# EAGLE board washberry (EAGLE 6.4)
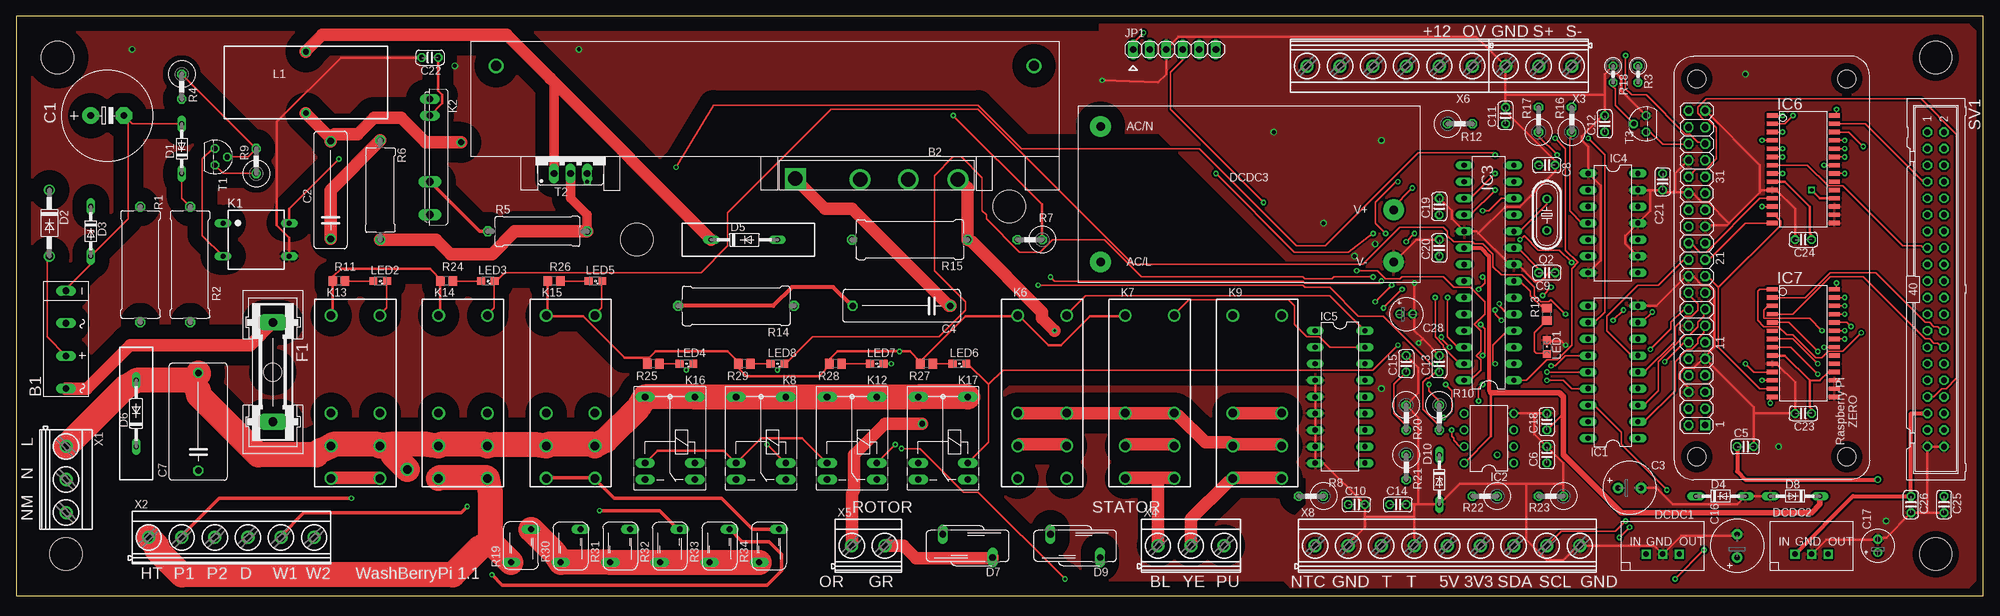
[diagram p3: board, top side]
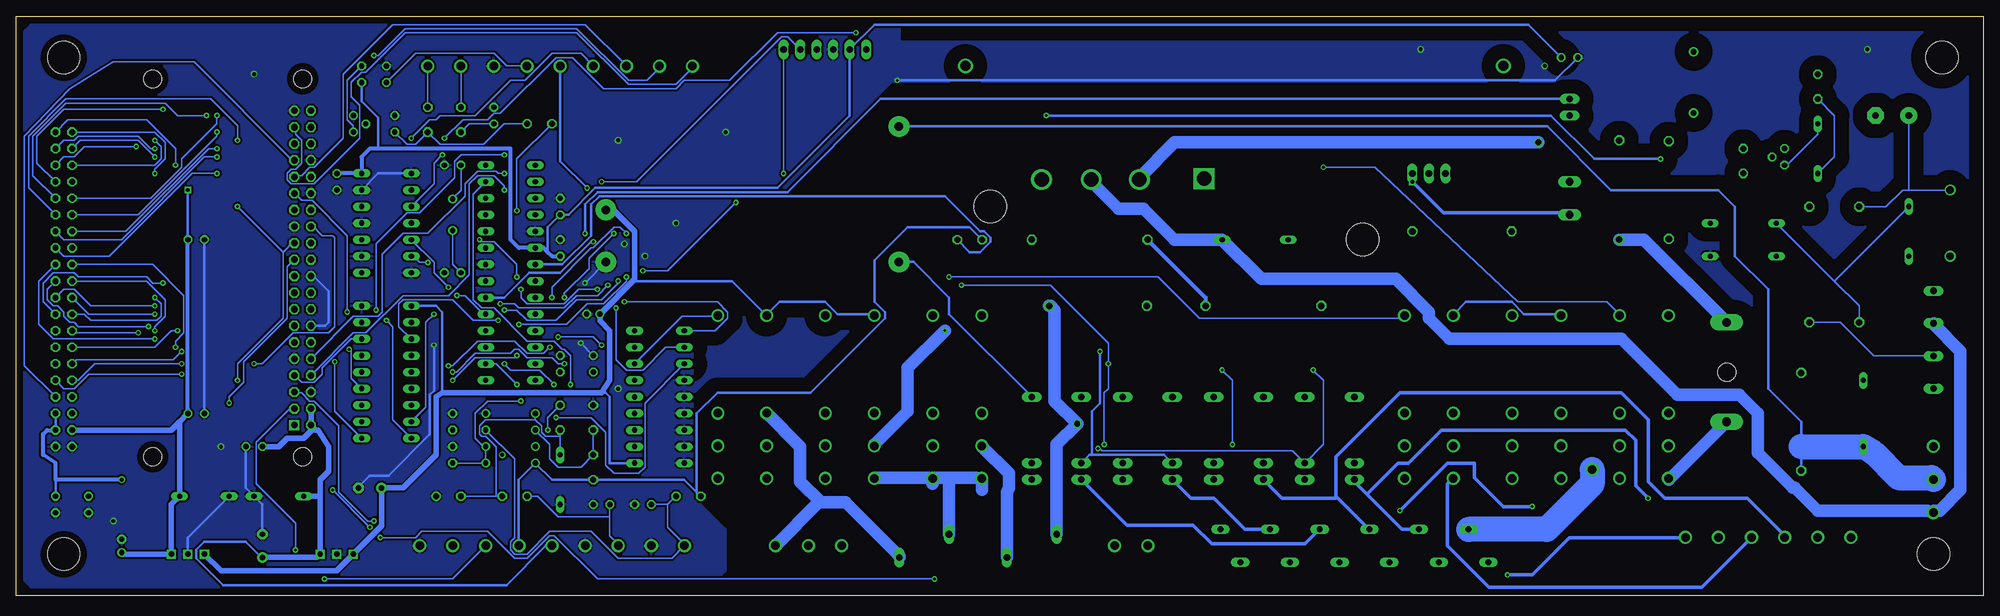
[diagram p4: board, bottom side, seen from below]

Size 301.93 x 88.89 mm. Coordinates in mm from the lower left corner, seen from the top.
Outline: 0,0 301.93,0 301.93,88.89 0,88.89 0,0
Copper layers (1*16): Top 0.035mm / dielectric 1.5mm / Bottom 0.035mm
Design rules "default *": minimum track width 5mil, minimum drill 0.4mm, track to track 6mil, track to pad 6mil, pad to pad 6mil, via to via 6mil, smd to smd 6mil, copper to edge 40mil, drill to drill 8mil, minimum pad ring 10mil, minimum via ring 8mil, stop-mask expansion 4mil, vias tented up to drill 0mil, thermal gap 10mil
Net classes: 0 default: width 0.254 mm; 1 10A: width 3.81 mm, drill 0.001 mm, clearance 1.016 mm; 2 5A: width 1.905 mm, drill 0.001 mm, clearance 1.016 mm; 3 2A: width 0.635 mm, drill 0.001 mm, clearance 1.016 mm; 4 0.5: width 0.508 mm, drill 0.001 mm, clearance 1.016 mm; 5 0.25: width 0.254 mm, clearance 1.016 mm; 6 12V: width 0.406 mm; 7 5V: width 0.406 mm; 8 3V3: width 0.406 mm; 9 small_signal: width 0.203 mm; 10 GND: width 0.406 mm; 11 TRIAC: width 0.406 mm
Holes 5 mm at 6.35,82.55 7.62,6.35 294.64,6.35 294.64,82.55 95.25,54.61 152.4,59.69

## Footprints (pad centres in the part's own frame; a part is rotated, then mirrored left to right if it is on the bottom)
2KBB = drill 1.016 long: + -2.616,0; - 7.391,0; AC1 -7.62,0; AC2 2.413,0
5S = drill 2.2 square: + 2.49,1.69 | drill 2.2: - 27.44,1.54; AC1 12.45,1.54; AC2 19.82,1.54
E5-13 = drill 1.016 pad 2.54: + -2.54,0 | drill 1.016 pad 2.54 octagon: - 2.54,0
C150-054X183 = drill 1.016 octagon: 1 -7.493,0; 2 7.493,0
E3,5-8 = drill 0.813 pad 1.6: + -1.778,0 | drill 0.813 pad 1.6 octagon: - 1.778,0
C025-024X044 = drill 0.813 octagon: 1 -1.27,0; 2 1.27,0
C150-091X182 = drill 1.016 octagon: 1 -7.493,0; 2 7.493,0
E2-5 = drill 0.813 pad 1.27: + -1.016,0 | drill 0.813 pad 1.27 octagon: - 1.016,0
DO34Z7 = drill 0.813 long: A 3.81,0; C -3.81,0
DO41-10 = drill 1.118: A 5.08,0; C -5.08,0
DO35-10 = drill 0.813 long: A 5.08,0; C -5.08,0
S10K300 = drill 1.016 long: 1 -1.778,-3.81; 2 1.778,3.81
SIPTO220 = drill 0.813 pad 1.397 square: 1 -2.54,-1.27; 2 0,-1.27; 3 2.54,-1.27
IRM_15/20 = drill 1.3 pad 3.17: AC/L -22.8,-10.4; AC/N -22.8,10.4; V+ 22.2,-2.4; V- 22.2,-10.4
GSH15 = drill 1.321 pad 2.54 long: 1 -7.62,0; 2 7.62,0 | hole 2.794: 0,0
DIL18 = drill 0.813 long: 1 -10.16,-3.81; 2 -7.62,-3.81; 3 -5.08,-3.81; 4 -2.54,-3.81; 5 0,-3.81; 6 2.54,-3.81; 7 5.08,-3.81; 8 7.62,-3.81; 9 10.16,-3.81; 10 10.16,3.81; 11 7.62,3.81; 12 5.08,3.81; 13 2.54,3.81; 14 0,3.81; 15 -2.54,3.81; 16 -5.08,3.81; 17 -7.62,3.81; 18 -10.16,3.81
DIL08 = drill 0.813 pad 1.27: 1 -3.81,-3.81; 2 -1.27,-3.81; 3 1.27,-3.81; 4 3.81,-3.81; 5 3.81,3.81; 6 1.27,3.81; 7 -1.27,3.81; 8 -3.81,3.81
DIL28-3 = drill 0.813 long: 1 -16.51,-3.81; 2 -13.97,-3.81; 3 -11.43,-3.81; 4 -8.89,-3.81; 5 -6.35,-3.81; 6 -3.81,-3.81; 7 -1.27,-3.81; 8 1.27,-3.81; 9 3.81,-3.81; 10 6.35,-3.81; 11 8.89,-3.81; 12 11.43,-3.81; 13 13.97,-3.81; 14 16.51,-3.81; 15 16.51,3.81; 16 13.97,3.81; 17 11.43,3.81; 18 8.89,3.81; 19 6.35,3.81; 20 3.81,3.81; 21 1.27,3.81; 22 -1.27,3.81; 23 -3.81,3.81; 24 -6.35,3.81; 25 -8.89,3.81; 26 -11.43,3.81; 27 -13.97,3.81; 28 -16.51,3.81
DIL14 = drill 0.813 long: 1 -7.62,-3.81; 2 -5.08,-3.81; 3 -2.54,-3.81; 4 0,-3.81; 5 2.54,-3.81; 6 5.08,-3.81; 7 7.62,-3.81; 8 7.62,3.81; 9 5.08,3.81; 10 2.54,3.81; 11 0,3.81; 12 -2.54,3.81; 13 -5.08,3.81; 14 -7.62,3.81
SO28W = smd 0.65 x 1.7: 1 -7.62,-4.78; 2 -6.35,-4.78; 3 -5.08,-4.78; 4 -3.81,-4.78; 5 -2.54,-4.78; 6 -1.27,-4.78; 7 0,-4.78; 8 1.27,-4.78; 9 2.54,-4.78; 10 3.81,-4.78; 11 5.08,-4.78; 12 6.35,-4.78; 13 7.62,-4.78; 14 8.89,-4.78; 15 8.89,4.78; 16 7.62,4.78; 17 6.35,4.78; 18 5.08,4.78; 19 3.81,4.78; 20 2.54,4.78; 21 1.27,4.78; 22 0,4.78; 23 -1.27,4.78; 24 -2.54,4.78; 25 -3.81,4.78; 26 -5.08,4.78; 27 -6.35,4.78; 28 -7.62,4.78
1X06 = drill 1.016 long: 1 -6.35,0; 2 -3.81,0; 3 -1.27,0; 4 1.27,0; 5 3.81,0; 6 6.35,0
AQY27 = drill 0.8 long: 1 -2.54,-5.08; 2 2.54,-5.08; 3 2.54,5.08; 4 -2.54,5.08
AQZ-SIL04 = drill 1 long: 1 -8.89,0; 2 -6.35,0 | drill 1.2 long: 3 3.81,0; 4 8.89,0
FTR-K1C = drill 1.3 pad 1.93: 1 -12.5,-3.75; 2 2.5,-3.75; 3 7.5,-3.75; 4 12.5,-3.75; 5 12.5,3.75; 6 7.5,3.75; 7 2.5,3.75; 8 -12.5,3.75
M3XXH = drill 1.016 long: 1 -3.81,3.81; 2 -3.81,-3.81; O -6.35,-3.81; P 6.35,-3.81; P@ 6.35,3.81; S -6.35,3.81
TJ5-U1 = drill 0.9: 1 -4.7,0; 2 4.7,0
CHIPLED_0805 = smd 1.2 x 1.2: A 0,-1.05; C 0,1.05
SML0805 = smd 1.2 x 1.2: A 1.05,0; C -1.05,0
HC49/S = drill 0.813: 1 -2.413,0; 2 2.413,0
0617/17 = drill 1.016 octagon: 1 -8.89,0; 2 8.89,0
0207/2V = drill 0.813 octagon: 1 -1.27,0; 2 1.27,0
0411V = drill 0.914 octagon: 1 -2.54,0; 2 1.27,0
P0613/15 = drill 1.016 octagon: 1 -7.62,0; 2 7.62,0
R0805 = smd 1.3 x 1.5: 1 -0.95,0; 2 0.95,0
S05K275 = drill 0.914 long: 1 -1.524,-2.54; 2 1.524,2.54
W_HEATSINK = drill 1.5: P$1 -40.64,5.08; P$2 41.91,5.08
ML40 = drill 0.914 octagon: 1 -24.13,-1.27; 2 -24.13,1.27; 3 -21.59,-1.27; 4 -21.59,1.27; 5 -19.05,-1.27; 6 -19.05,1.27; 7 -16.51,-1.27; 8 -16.51,1.27; 9 -13.97,-1.27; 10 -13.97,1.27; 11 -11.43,-1.27; 12 -11.43,1.27; 13 -8.89,-1.27; 14 -8.89,1.27; 15 -6.35,-1.27; 16 -6.35,1.27; 17 -3.81,-1.27; 18 -3.81,1.27; 19 -1.27,-1.27; 20 -1.27,1.27; 21 1.27,-1.27; 22 1.27,1.27; 23 3.81,-1.27; 24 3.81,1.27; 25 6.35,-1.27; 26 6.35,1.27; 27 8.89,-1.27; 28 8.89,1.27; 29 11.43,-1.27; 30 11.43,1.27; 31 13.97,-1.27; 32 13.97,1.27; 33 16.51,-1.27; 34 16.51,1.27; 35 19.05,-1.27; 36 19.05,1.27; 37 21.59,-1.27; 38 21.59,1.27; 39 24.13,-1.27; 40 24.13,1.27
TO92 = drill 0.813 octagon: 1 1.27,0; 2 0,1.905; 3 -1.27,0
TO220BV = drill 1.016 long: G 2.54,-2.54; T1 -2.54,-2.54; T2 0,-2.54
ZERO_NO_DIMENSION = drill 1.016 square: 1 8.37,25.24 | drill 1.016 octagon: 2 8.37,27.78; 3 10.91,25.24; 4 10.91,27.78; 5 13.45,25.24; 6 13.45,27.78; 7 15.99,25.24; 8 15.99,27.78; 9 18.53,25.24; 10 18.53,27.78; 11 21.07,25.24; 12 21.07,27.78; 13 23.61,25.24; 14 23.61,27.78; 15 26.15,25.24; 16 26.15,27.78; 17 28.69,25.24; 18 28.69,27.78; 19 31.23,25.24; 20 31.23,27.78; 21 33.77,25.24; 22 33.77,27.78; 23 36.31,25.24; 24 36.31,27.78; 25 38.85,25.24; 26 38.85,27.78; 27 41.39,25.24; 28 41.39,27.78; 29 43.93,25.24; 30 43.93,27.78; 31 46.47,25.24; 32 46.47,27.78; 33 49.01,25.24; 34 49.01,27.78; 35 51.55,25.24; 36 51.55,27.78; 37 54.09,25.24; 38 54.09,27.78; 39 56.63,25.24; 40 56.63,27.78 | hole 2.75: 3.5,3.5; 3.5,26.5; 61.5,26.5; 61.5,3.5
MKDSN1,5/3-5,08 = drill 1.3 pad 2: 1 -7.641,0.025; 2 -2.561,0.025; 3 2.519,0.025
MKDSN1,5/6-5,08 = drill 1.3 pad 2: 1 -12.7,0.025; 2 -7.62,0.025; 3 -2.54,0.025; 4 2.54,0.025; 5 7.62,0.025; 6 12.7,0.025
MKDSN1,5/2-5,08 = drill 1.3 pad 2: 1 -2.561,0.025; 2 2.519,0.025
MKDSN1,5/9-5,08 = drill 1.3 pad 2: 1 -20.341,0.025; 2 -15.261,0.025; 3 -10.181,0.025; 4 -5.101,0.025; 5 -0.021,0.025; 6 5.059,0.025; 7 10.139,0.025; 8 15.219,0.025; 9 20.299,0.025

## Placement (x,y rotation side)
B1  [2KBB]  7.62,39.37 90 top
B2  D15XB60  [5S]  117.1,62.3 0 top
C1  470µ  [E5-13]  13.97,73.66 0 top
C2  1nF  [C150-054X183]  48.26,62.23 90 top
C3  100µF  [E3,5-8]  247.65,16.51 0 top
C4  100nF  [C150-054X183]  135.89,44.45 180 top
C5  100nF  [C025-024X044]  265.43,22.86 0 top
C6  100nF  [C025-024X044]  234.95,21.59 90 top
C7  1nF  [C150-091X182]  27.94,26.67 90 top
C8  20pF  [C025-024X044]  234.95,66.04 0 top
C9  20pF  [C025-024X044]  234.95,49.53 0 top
C10  22nF  [C025-024X044]  205.74,13.97 0 top
C11  0 optional  [C025-024X044]  228.6,73.66 90 top
C12  100nF  [C025-024X044]  243.84,72.39 90 top
C13  22pF  [C025-024X044]  218.44,35.56 90 top
C14  100nF  [C025-024X044]  212.09,13.97 0 top
C15  100nF  [C025-024X044]  213.36,35.56 90 top
C16  100µF  [E3,5-8]  264.16,7.62 90 top
C17  100µF  [E2-5]  285.75,7.62 90 top
C18  100nF  [C025-024X044]  234.95,26.67 90 top
C19  100nF  [C025-024X044]  218.44,59.69 90 top
C20  100nF  [C025-024X044]  218.44,53.34 90 top
C21  100nF  [C025-024X044]  252.73,63.5 270 top
C22  100nF  [C025-024X044]  63.5,82.55 180 top
C23  100nF  [C025-024X044]  274.32,27.94 180 top
C24  100nF  [C025-024X044]  274.32,54.61 180 top
C25  100nF  [C025-024X044]  295.91,13.97 270 top
C26  100nF  [C025-024X044]  290.83,13.97 270 top
C28  [E2-5]  213.36,43.18 0 top
D1  12V  [DO34Z7]  25.4,68.58 90 top
D2  1N4004  [DO41-10]  5.08,57.15 270 top
D3  5V  [DO34Z7]  11.43,55.88 270 top
D4  5V8  [DO34Z7]  261.62,15.24 0 top
D5  [DO35-10]  111.76,54.61 0 top
D6  [DO35-10]  18.41,27.94 90 top
D7  S10K300  [S10K300]  146.05,7.62 90 top
D8  3V6  [DO34Z7]  273.05,15.24 180 top
D9  S10K300  [S10K300]  162.56,7.62 90 top
D10  3V3  [DO34Z7]  218.44,17.78 270 top
DCDC1  TSR1-2405  [SIPTO220]  252.73,7.62 0 top
DCDC2  TSR1-2405  [SIPTO220]  275.59,7.62 0 top
DCDC3  IRM-15-12  [IRM_15/20]  189.23,61.59 0 top
F1  5A  [GSH15]  39.37,34.29 270 top
IC1  ULN2803  [DIL18]  245.11,34.29 90 top
IC2  LM358N  [DIL08]  226.06,24.13 90 top
IC3  PIC18F2550_28DIP  [DIL28-3]  226.06,49.53 90 top
IC4  74HC04N  [DIL14]  245.11,57.15 270 top
IC5  ULN2803  [DIL18]  203.2,30.48 270 top
IC6  MCP23S17SO  [SO28W]  274.32,66.04 270 top
IC7  MCP23S17SO  [SO28W]  274.32,39.37 270 top
JP1  ISCP  [1X06]  177.8,83.82 0 top
K1  AQYAQY27  [AQY27]  36.83,54.61 270 top
K2  AQZ204  [AQZ-SIL04]  63.5,67.31 270 top
K6  FTR-K1C  [FTR-K1C]  157.48,30.48 270 top
K7  FTR-K1C  [FTR-K1C]  173.99,30.48 270 top
K8  M3XXH  [M3XXH]  114.3,24.13 90 top
K9  FTR-K1C  [FTR-K1C]  190.5,30.48 270 top
K12  M3XXH  [M3XXH]  128.27,24.13 90 top
K13  FTR-K1C  [FTR-K1C]  52.07,30.48 270 top
K14  FTR-K1C  [FTR-K1C]  68.58,30.48 270 top
K15  FTR-K1C  [FTR-K1C]  85.09,30.48 270 top
K16  M3XXH  [M3XXH]  100.33,24.13 90 top
K17  M3XXH  [M3XXH]  142.24,24.13 90 top
L1  [TJ5-U1]  44.45,78.74 270 top
LED1  [CHIPLED_0805]  234.95,38.1 0 top
LED2  [SML0805]  55.88,48.26 180 top
LED3  [SML0805]  72.39,48.26 180 top
LED4  [SML0805]  102.87,35.56 180 top
LED5  [SML0805]  88.9,48.26 180 top
LED6  [SML0805]  144.78,35.56 180 top
LED7  [SML0805]  132.08,35.56 180 top
LED8  [SML0805]  116.84,35.56 180 top
Q2  12MHz  [HC49/S]  234.95,58.42 270 top
R1  82K  [0617/17]  19.05,50.8 270 top
R2  100K  [0617/17]  26.67,50.8 270 top
R3  10K  [0207/2V]  248.92,80.01 270 top
R4  1K  [0411V]  25.4,77.47 270 top
R5  470  [P0613/15]  80.01,55.88 0 top
R6  68  [P0613/15]  55.88,62.23 270 top
R7  1K  [0411V]  154.94,54.61 180 top
R8  1K  [0411V]  198.12,15.24 180 top
R9  47K  [0411V]  36.83,67.31 90 top
R10  10K  [0411V]  218.44,26.67 270 top
R11  [R0805]  49.53,48.26 180 top
R12  1K  [0411V]  222.25,72.39 0 top
R13  1K  [R0805]  234.95,43.18 90 top
R14  68  [0617/17]  110.49,44.45 180 top
R15  68  [0617/17]  137.16,54.61 180 top
R16  0  [0411V]  238.76,73.66 90 top
R17  0  [0411V]  233.68,73.66 90 top
R18  470K  [0207/2V]  245.11,80.01 270 top
R19  S05K275  [S05K275]  77.47,7.62 180 top
R20  1K  [0411V]  213.36,26.67 270 top
R21  8K2  [0411V]  213.36,19.05 270 top
R22  1K  [0411V]  224.79,15.24 180 top
R23  47K  [0411V]  234.95,15.24 180 top
R24  [R0805]  66.04,48.26 180 top
R25  [R0805]  97.79,35.56 180 top
R26  [R0805]  82.55,48.26 180 top
R27  [R0805]  139.7,35.56 180 top
R28  [R0805]  125.73,35.56 180 top
R29  [R0805]  111.76,35.56 180 top
R30  S05K275  [S05K275]  85.09,7.62 0 top
R31  S05K275  [S05K275]  92.71,7.62 0 top
R32  S05K275  [S05K275]  100.33,7.62 0 top
R33  S05K275  [S05K275]  107.95,7.62 0 top
R34  S05K275  [S05K275]  115.57,7.62 0 top
SINK1  HEATSINK  [W_HEATSINK]  114.3,76.2 0 top
SV1  [ML40]  294.64,46.99 270 top
T1  BC547  [TO92]  30.48,67.31 270 top
T2  BTA25-6CWG  [TO220BV]  85.09,67.31 0 top
T3  BC547  [TO92]  250.19,72.39 90 top
U$3  ZERO  [ZERO_NO_DIMENSION]  284.48,17.78 90 top
X1  [MKDSN1,5/3-5,08]  7.62,15.24 270 top
X2  MKDSN1,5/6-5,08  [MKDSN1,5/6-5,08]  33.02,8.89 0 top
X3  MKDSN1,5/3-5,08  [MKDSN1,5/3-5,08]  231.14,81.28 180 top
X4  MKDSN1,5/3-5,08  [MKDSN1,5/3-5,08]  182.88,7.62 0 top
X5  MKDSN1,5/2-5,08  [MKDSN1,5/2-5,08]  130.81,7.62 0 top
X6  MKDSN1,5/6-5,08  [MKDSN1,5/6-5,08]  210.82,81.28 180 top
X8  MKDSN1,5/9-5,08  [MKDSN1,5/9-5,08]  219.71,7.62 0 top

## Tracks (layer width: path | path; a pad name or v marks a point on that pad's centre or on a via)
+3V3  (via drill 0.6)
  Top 0.305: 275.27,33.02 276.86,33.02 278.13,34.29 IC7.18
  Top 0.406: 226.38,31.11 226.38,24.45 IC2.8 | C22.1 64.77,77.47 65.41,76.83 65.41,75.56 K2.2 | IC7.9 271.46,36.83 275.27,33.02 275.27,28.89 275.59,28.57 C23.1 | IC6.9 271.46,63.5 275.27,59.69 275.27,55.56 275.59,55.24 C24.1 | C18.1 237.17,27.62 237.49,27.62 | v275.59,62.23 276.86,60.96 IC6.18
  Top 0.61: IC3.20 224.79,53.34 226.06,52.07 226.06,31.43 226.38,31.11
  Top 0.813: 226.38,31.11 236.85,31.11 237.49,30.48 237.49,27.62 237.49,21.59 246.38,12.7 275.59,12.7 276.86,13.97 D8.C
  Bottom 0.406: C24.1 v275.59,62.23 | 197.49,15.88 199.39,17.78 R21.2 219.71,17.78 IC2.8 224.79,17.78 224.79,7.94 X8.6 | 197.49,15.88 R8.2 | R7.2 155.57,56.52 165.1,56.52 170.18,51.44 170.18,45.09 168.59,43.5 168.59,42.55 180.02,31.11 194.31,31.11 197.49,27.94 197.49,15.88 | 220.5,52.86 220.34,53.02 220.34,56.52 C19.1 217.17,58.42 213.04,62.55 185.1,62.55 173.99,73.66 JP1.2 170.18,87.63 69.85,87.63 C22.1 | R3.2 248.92,75.88 246.38,73.34 246.38,68.58
  Bottom 0.61: C23.1 C24.1 | C20.1 219.71,52.07 220.5,52.86 220.98,53.34 IC3.20 224.79,53.34 226.06,54.61 226.06,68.58 246.38,68.58 247.65,68.58 248.92,67.31 IC4.14 C21.1
  Bottom 0.813: C17.+ 285.5,6.35 DCDC2.3 278.13,13.97 D8.C 276.86,26.67 | SV1.37 278.13,25.4 276.86,26.67 | 276.86,26.67 C23.1
+5V  (via drill 0.6)
  Top 0.61: C5.1 264.16,19.05 265.43,17.78 v285.75,17.78
  Bottom 0.406: 295.91,17.78 C25.1 | SV1.38 SV1.36 | X8.5 219.71,7.62 220.66,7.62 226.69,1.59 270.19,1.59 274.32,5.71 274.32,6.99 273.05,8.26 266.7,8.26 264.48,6.03 C16.+
  Bottom 0.61: v285.75,17.78 295.91,17.78 295.91,20.32 297.81,21.59 297.81,24.77 297.18,25.4 SV1.38
  Bottom 0.813: 255.27,15.24 DCDC1.3 255.78,5.84 C16.+ | D4.C 255.27,15.24 | 255.27,15.24 255.27,17.78 254,19.05 254,22.86 255.59,25.4 255.95,25.4 256.25,25.7 | 256.25,25.7 U$3.2 U$3.4 | C5.1 261.62,22.86 260.35,24.13 257.81,24.13 256.25,25.7
+12V  (via drill 0.4)
  Top 0.406: R11.2 48.58,43.18 K13.1 | K14.1 65.09,43.18 R24.2 65.41,48.26 63.5,50.16 49.85,50.16 48.58,48.9 R11.2 | R11.2 | R26.2 81.6,43.18 K15.1 81.6,42.86 87,42.86 93.34,36.51 97.16,36.51 | 97.16,36.51 98.11,37.47 109.22,37.47 111.12,35.56 R29.2 110.81,34.92 112.08,33.66 123.19,33.66 125.09,35.56 R28.2 124.78,36.2 126.05,37.47 v135.57,37.47 137.16,37.47 138.75,35.88 | 97.16,36.51 96.84,36.2 R25.2 | K16.1 98.42,22.23 108.58,22.23 K8.1 114.3,24.13 120.65,24.13 K12.1 | v214.31,62.55 211.14,59.37 DCDC3.V+ | 138.75,35.88 139.06,35.56 R27.2 138.75,35.88 | 138.75,35.88 145.73,42.86 153.67,42.86 K6.1 153.99,42.86 158.43,38.42 160.34,38.42 164.78,42.86 170.18,42.86 K7.1
  Top 0.61: DCDC2.1 281.94,15.24 C26.1 290.83,27.94 SV1.35
  Bottom 0.406: 236.54,31.11 236.54,43.5 237.49,44.45 IC1.10 | 212.09,31.11 211.46,31.11 210.82,30.48 210.82,20.32 IC5.10 | K14.1 65.09,43.18 70.48,43.18 72.39,45.09 79.38,45.09 81.28,43.18 K15.1 | K17.1 137.16,21.59 136.84,21.59 | 136.84,21.59 125.73,21.59 K12.1 | X6.2 218.44,66.67 v214.31,62.55 | K7.1 170.5,43.18 175.9,43.18 177.8,45.09 184.78,45.09 186.69,43.18 K9.1 187.01,43.18 192.09,48.26 206.69,48.26 207.01,48.51 | 136.84,21.59 136.84,28.26 135.57,29.53 v135.57,37.47
  Bottom 0.813: DCDC3.V+ 210.32,59.2 207.01,55.88 207.01,48.51 C28.+ 212.34,42.16 210.82,40.64 210.82,33.02 212.09,31.11 236.54,31.11 237.49,30.48 237.49,21.59 242.57,16.51 C3.+ 245.87,10.67 DCDC1.1 252.73,3.81 270.51,3.81 DCDC2.1
BOOST  (via drill 0.4)
  Top 0.203: v219.07,27.3 219.39,27.3 220.34,28.26 220.34,31.43 v219.39,32.38 | v227.01,35.56 226.69,35.88 226.69,38.42 228.92,40.64 IC3.4
  Bottom 0.203: IC5.3 205.42,29.53 205.42,19.68 206.38,18.73 210.19,18.73 211.46,20 211.46,25.08 213.68,27.3 v219.07,27.3 | v219.39,32.38 221.62,34.61 226.06,34.61 v227.01,35.56
CS0
  Top 0.254: IC6.11 267.65,60.96 259.4,52.7 258.44,52.7 256.86,54.29 U$3.24
CS1  (via drill 0.4)
  Top 0.254: IC7.11 266.7,34.29 v265.43,35.56
  Bottom 0.254: v265.43,35.56 264.16,35.56 259.4,40.32 254,40.32 253.05,41.27 253.05,54.93 253.37,55.24 254.95,55.24 256.54,56.83 U$3.26
DIRECTION  (via drill 0.4)
  Top 0.203: v211.14,47.62 v208.6,45.09 | v227.65,44.77 227.65,44.45 228.92,43.18 IC3.5 | v234.31,46.04 v235.59,47.31
  Bottom 0.203: IC5.1 194.63,40.64 192.72,42.55 192.72,43.5 194.31,45.09 v208.6,45.09 | v211.14,47.62 212.72,46.04 215.9,46.04 217.81,44.13 224.79,44.13 225.43,44.77 v227.65,44.77 | IC4.5 237.81,51.12 237.81,49.53 v235.59,47.31 | v234.31,46.04 233.04,46.04 230.19,43.18 IC3.5
GND  (via drill 0.4, 0.6)
  Top 0.406: C18.2 233.04,27.94 | 233.04,27.94 IC2.4 | 233.04,27.94 233.04,24.77 C6.2 237.49,20.32 237.49,17.14 | 237.49,17.14 R23.1 | C20.2 214.95,54.61 211.46,51.12 DCDC3.V- | IC5.4 IC5.5 IC5.6 IC5.7 IC5.8 IC5.9 200.66,20.32 C10.2 207.01,12.06 | 207.01,12.06 207.01,10.48 204.47,7.94 X8.2 | 214.63,43.18 214.63,40.64 215.9,39.37 | C13.2 215.9,39.37 | C15.2 215.26,34.92 215.26,31.11 R20.1 215.26,27.3 215.26,13.97 | 215.26,13.97 D10.A 221.62,17.14 231.78,17.14 | 215.26,13.97 214.63,13.97 | 214.63,13.97 C14.2 | 214.63,13.97 214.63,12.06 | 214.63,12.06 214.63,7.94 X8.4 | v215.26,38.73 215.9,39.37 | 214.63,12.06 207.01,12.06 | 214.63,43.18 v214.63,47.94 | 214.63,43.18 C28.- | 231.78,17.14 237.49,17.14 | v237.81,38.42 237.17,39.05 234.95,39.05 LED1.C | C16.- 264.16,9.21 255.59,9.21 DCDC1.2 251.46,7.62 240.03,7.62 X8.9 239.71,7.62 237.49,5.4 234.95,5.4 231.78,8.57 231.78,17.14 | SV1.40 SV1.39 293.37,12.7 | 293.37,12.7 C26.2 287.02,8.89 285.75,8.89 C17.- 285.75,8.57 277.81,8.57 DCDC2.2 | 293.37,12.7 C25.2 | IC1.9 251.78,44.45 256.54,49.21 U$3.20 256.86,48.9 257.49,48.9 258.76,47.62 259.71,47.62 260.67,46.67 260.67,38.1 259.08,36.51 | IC7.10 270.19,35.56 273.05,32.7 C23.2 266.7,27.94 | 259.08,36.51 257.49,34.92 256.22,34.92 255.27,33.97 255.27,33.34 256.54,32.07 256.54,31.43 U$3.6 | D8.A D4.A 264.16,13.97 254.32,13.97 251.78,16.51 C3.- | C5.2 266.7,27.94 | 266.7,27.94 266.7,28.89 259.4,36.2 U$3.9 259.08,36.51 | IC4.7 243.21,51.44 243.21,62.87 IC4.1 241.3,68.9 240.35,69.85 240.35,70.48 243.84,73.98 | IC4.9 247.01,53.98 247.01,55.24 IC4.11 250.82,59.05 250.82,62.23 | 250.82,62.23 C21.2 253.05,61.91 254.63,61.91
  Top 0.406: 250.82,62.23 IC4.13 | 254.63,61.91 256.54,61.91 U$3.30 256.86,61.59 257.49,61.59 258.76,60.33 259.71,60.33 262.89,57.15 | 254.63,61.91 254.63,64.77 256.54,66.67 U$3.34 | C24.2 273.05,59.37 270.19,62.23 IC6.10 267.97,62.23 267.65,61.91 | 267.65,61.91 262.89,57.15 | 262.89,57.15 262.57,56.83 259.4,56.83 U$3.25 | 267.65,61.91 267.65,66.04 259.4,74.3 U$3.39 | K1.3 41.91,54.93 40.01,56.83 40.01,72.71 49.85,82.55 C22.2 | C19.2 220.34,59.05 220.34,57.78 IC3.19 224.16,55.88 224.47,55.56 | 224.47,55.56 229.24,50.8 IC3.8 230.5,50.8 233.04,48.26 234,48.26 235.27,49.53 C9.2 | 243.84,76.83 243.84,80.01 244.79,80.96 | 243.84,76.83 243.84,73.98 | T3.1 246.38,77.47 246.38,79.38 244.79,80.96 | 244.79,80.96 R18.1 | 228.6,76.83 228.6,80.96 X3.3 228.6,81.28 224.16,85.72 178.44,85.72 JP1.3 176.53,80.01 175.26,78.74 v166.69,79.06 | 228.6,76.83 C11.2 228.6,74.3 236.22,66.67 C8.2 236.22,65.09 230.82,59.69 228.6,59.69 224.47,55.56 | 228.6,76.83 243.84,76.83 | 243.84,73.98 C12.2
  Bottom 0.406: C15.2 v215.26,38.73 | v214.63,47.94 211.46,51.12 DCDC3.V- | v237.81,38.42 237.81,31.43 238.44,30.8 238.44,24.77 244.79,18.41 247.65,18.41 249.56,16.51 C3.- | C5.2 266.7,16.51 D4.A 264.16,13.97 C16.- | DCDC2.2 275.59,8.89 D8.A | IC4.1 246.38,64.77 IC4.13 | C22.2 65.72,79.06 v166.69,79.06 | C24.2 C23.2 | U$3.14 254.52,41.39 254,41.91 254,46.67 256.22,48.9 256.58,48.9 U$3.20
  other vias: 193.04,71.12 209.55,69.85 265.43,80.01 270.51,22.86 287.02,11.43 209.55,31.75 17.78,83.82 200.66,57.15 205.42,52.07 208.6,53.98 67.31,81.28 86.36,83.82
  pour Bottom (isolate 2.184): 1.27,86.36 2.54,87.63 299.72,87.63 300.99,86.36 300.99,2.54 299.72,1.27 2.54,1.27 1.27,2.54
  pour Top (isolate 2.184): 1.27,86.36 2.54,87.63 299.72,87.63 300.99,86.36 300.99,2.54 299.72,1.27 2.54,1.27 1.27,2.54
  pour Bottom (isolate 0.305): 166.37,82.55 166.37,87.63 299.72,87.63 300.99,86.36 300.99,2.54 299.72,1.27 195.58,1.27 193.04,3.81 193.04,10.16 198.12,15.24 198.12,48.26 166.37,80.01
  pour Top (isolate 0.305): 166.37,80.01 166.37,87.63 299.72,87.63 300.99,86.36 300.99,2.54 299.72,1.27 195.58,1.27 194.31,2.54 194.31,10.16 198.12,13.97 198.12,48.26 196.85,49.53
GPA1.0  (via drill 0.4)
  Top 0.254: v280.67,64.77 IC6.21
  Bottom 0.254: v280.67,64.77 280.67,65.41 279.08,66.99 279.08,69.53 280.67,71.12 SV1.1
GPA1.1  (via drill 0.4)
  Top 0.254: v277.5,66.04 IC6.22
  Bottom 0.254: v277.5,66.04 277.5,68.58 281.94,73.03 294,73.03 SV1.2
GPA1.2  (via drill 0.4)
  Top 0.254: v280.67,67.31 IC6.23
  Bottom 0.254: v280.67,67.31 283.21,69.85 292.1,69.85 SV1.3
GPA1.3  (via drill 0.4)
  Top 0.254: v280.67,68.58 IC6.24
  Bottom 0.254: v280.67,68.58 281.31,68.58 283.21,70.48 292.42,70.48 293.05,69.85 294.64,69.85 SV1.4
GPA1.4  (via drill 0.4)
  Top 0.254: v280.67,69.85 IC6.25
  Bottom 0.254: v280.67,69.85 279.72,68.9 279.72,66.99 280.67,66.04 SV1.5
GPA1.5  (via drill 0.4)
  Top 0.254: IC6.26 281.31,71.12 v283.53,68.9
  Bottom 0.254: v283.53,68.9 291.46,68.9 293.05,67.31 294.64,67.31 SV1.6
GPA1.6
  Top 0.254: IC6.27 283.85,72.39 292.74,63.5 SV1.7
GPA1.7  (via drill 0.4)
  Top 0.254: v279.4,74.61 279.4,73.66 IC6.28
  Bottom 0.254: v279.4,74.61 294.64,74.61 298.77,70.48 298.77,66.36 SV1.8
GPA2.0  (via drill 0.4)
  Top 0.254: v277.5,38.1 IC7.21
  Bottom 0.254: v277.5,38.1 277.5,39.05 276.23,40.32 276.23,46.04 280.99,50.8 SV1.17
GPA2.1  (via drill 0.4)
  Top 0.254: v280.67,39.37 IC7.22
  Bottom 0.254: v280.67,39.37 296.23,39.37 298.45,41.59 298.45,48.26 SV1.18
GPA2.2  (via drill 0.4)
  Top 0.254: v280.67,40.64 IC7.23
  Bottom 0.254: v280.67,40.64 280.67,41.27 279.08,42.86 279.08,45.4 281.94,48.26 SV1.19
GPA2.3  (via drill 0.4)
  Top 0.254: IC7.24 280.99,41.91 v281.62,41.27
  Bottom 0.254: v281.62,41.27 292.42,41.27 293.05,41.91 293.69,41.91 294.64,42.86 294.64,43.5 295.59,44.45 296.23,44.45 297.18,45.4 297.18,46.99 SV1.20
GPA2.4  (via drill 0.4)
  Top 0.254: v280.67,43.18 IC7.25
  Bottom 0.254: v280.67,43.18 290.83,43.18 SV1.21
GPA2.5  (via drill 0.4)
  Top 0.254: v280.67,44.45 IC7.26
  Bottom 0.254: v280.67,44.45 290.51,44.45 293.05,46.99 294.64,46.99 SV1.22
GPA2.6  (via drill 0.4)
  Top 0.254: v280.67,45.72 IC7.27
  Bottom 0.254: v280.67,45.72 279.72,44.77 279.72,42.86 280.35,42.23 290.51,42.23 291.46,43.18 SV1.23
GPA2.7  (via drill 0.4)
  Top 0.254: v279.4,47.94 279.4,46.99 IC7.28
  Bottom 0.254: v279.4,47.94 280.99,47.94 281.94,48.9 292.42,48.9 293.05,49.53 296.23,49.53 297.81,47.94 297.81,45.09 SV1.24
GPB1.0  (via drill 0.4)
  Top 0.254: v271.14,73.66 IC6.1
  Bottom 0.254: v271.14,73.66 271.14,72.39 276.54,66.99 276.54,65.72 281.31,60.96 SV1.9
GPB1.1  (via drill 0.4)
  Top 0.254: IC6.2 271.46,72.39 v272.73,73.66
  Bottom 0.254: v272.73,73.66 277.18,73.66 279.08,75.56 294.32,75.56 299.4,70.48 299.4,64.45 SV1.10
GPB1.2  (via drill 0.4)
  Top 0.254: v271.14,71.12 IC6.3
  Bottom 0.254: v271.14,71.12 271.14,70.48 283.21,58.42 SV1.11
GPB1.3  (via drill 0.4)
  Top 0.254: v267.97,69.85 IC6.4
  Bottom 0.254: v267.97,69.85 267.97,72.07 272.1,76.2 294.32,76.2 300.04,70.48 300.04,62.55 SV1.12
GPB1.4  (via drill 0.4)
  Top 0.254: v271.14,68.58 IC6.5
  Bottom 0.254: v271.14,68.58 272.42,68.58 285.12,55.88 SV1.13
GPB1.5  (via drill 0.4)
  Top 0.254: v271.14,67.31 IC6.6
  Bottom 0.254: v271.14,67.31 273.05,67.31 285.75,54.61 294.64,54.61 SV1.14
GPB1.6
  Top 0.254: IC6.7 274.95,66.04 278.13,62.87 280.35,62.87 289.56,53.66 292.42,53.66 292.74,53.34 SV1.15
GPB1.7  (via drill 0.4)
  Top 0.254: v271.14,64.77 IC6.8
  Bottom 0.254: v271.14,64.77 274.95,64.77 287.65,52.07 294.64,52.07 SV1.16
GPB2.0  (via drill 0.4)
  Top 0.254: IC7.1 267.65,46.99 267.33,46.67 267.33,42.23 268.29,41.27 270.51,41.27 271.78,40.01 272.73,40.01 276.23,36.51 277.18,36.51 278.13,37.47 280.35,37.47 v283.21,40.32
  Bottom 0.254: v283.21,40.32 293.05,40.32 SV1.25
GPB2.1
  Top 0.254: IC7.2 274.64,45.72 278.45,49.53 285.43,49.53 293.05,41.91 293.69,41.91 294.32,41.27 294.96,41.27 295.59,40.64 SV1.26
GPB2.2  (via drill 0.4)
  Top 0.254: IC7.3 268.92,44.45 268.29,43.81 268.29,42.55 275.27,42.55 v277.18,40.64
  Bottom 0.254: v277.18,40.64 278.13,40.64 280.67,38.1 SV1.27
GPB2.3
  Top 0.254: IC7.4 272.73,43.18 278.45,48.9 283.53,48.9 293.05,39.37 293.69,39.37 294.32,38.73 294.96,38.73 295.59,38.1 SV1.28
GPB2.4  (via drill 0.4)
  Top 0.254: IC7.5 272.1,41.91 v276.54,37.47
  Bottom 0.254: v276.54,37.47 277.81,36.2 292.74,36.2 SV1.29
GPB2.6  (via drill 0.4)
  Top 0.254: IC7.7 272.73,39.37 v276.54,35.56
  Bottom 0.254: v276.54,35.56 289.88,35.56 292.42,33.02 SV1.31
GPB2.7  (via drill 0.4)
  Top 0.254: IC7.8 272.42,38.1 v276.54,33.97
  Bottom 0.254: v276.54,33.97 290.83,33.97 293.05,31.75 294.64,31.75 SV1.32
GPIO1  (via drill 0.4)
  Top 0.203: v253.05,35.88 255.91,38.73 256.54,38.73 U$3.12
  Bottom 0.203: IC1.1 253.05,28.26 v253.05,35.88
GPIO2
  Top 0.203: IC1.2 249.87,26.67 254.63,31.43 254.63,35.88 256.54,37.78 257.18,37.78 258.13,38.73 258.13,39.37 259.08,40.32 259.08,41.27 U$3.13
GPIO3
  Top 0.203: IC1.3 249.87,29.21 252.09,31.43 252.09,35.88 256.22,40.01 256.86,40.01 258.13,41.27 258.13,41.91 259.08,42.86 259.08,43.81 U$3.15
GPIO4  (via drill 0.4)
  Top 0.203: v250.82,37.78 254,40.96 254,41.91 255.91,43.81 256.54,43.81 U$3.16
  Bottom 0.203: IC1.4 250.51,33.34 250.51,37.47 v250.82,37.78
GPIO5
  Top 0.203: IC1.5 249.87,34.29 254.63,39.05 254.63,41.27 256.22,42.86 257.18,42.86 258.13,43.81 258.13,44.77 256.54,46.35 U$3.18
GPIO6
  Top 0.203: IC1.6 247.97,36.83 244.16,40.64 244.16,42.86 248.92,47.62 252.09,47.62 255.91,51.44 256.54,51.44 U$3.22
GPIO7
  Bottom 0.203: IC1.7 250.51,39.37 254.95,34.92 254.95,33.97 256.22,32.7 258.13,32.7 259.08,33.66 U$3.7
GPIO21  (via drill 0.4)
  Top 0.203: IC1.8 249.56,41.91 v251.14,43.5
  Bottom 0.203: v251.14,43.5 251.14,55.24 256.54,60.64 258.13,60.64 259.08,61.59 U$3.29
GPIO27
  Top 0.203: T3.3 250.82,71.12 252.73,69.22 256.54,69.22 U$3.36
  Bottom 0.203: T3.3 250.19,72.07 251.14,73.03 251.14,79.06 R3.1
INT  (via drill 0.4)
  Top 0.406: K1.4 41.91,59.37 v49.53,66.99 | v143.83,73.66 157.48,60.01 R7.1
  Bottom 0.406: v49.53,66.99 59.69,66.99 66.36,73.66 v143.83,73.66 | IC3.21 218.12,50.8 213.68,55.24 213.68,60.01 212.41,61.28 159.38,61.28 153.99,55.88 153.35,55.88 152.4,54.93 152.4,54.29 153.99,52.7 155.57,52.7 R7.1
L  (via drill 1.3)
  Top 3.81: K17.P K17.P@ K12.P K12.P@ K8.P K8.P@ K16.P K16.P@ 95.57,28.89 90.49,23.81 K15.6 88.58,23.18 81.6,23.18 K15.3 79.69,23.18 73.98,23.18 K14.6 72.07,23.18 65.09,23.18 K14.3 63.18,23.18 57.47,23.18 | 26.99,33.02 D6.A 16.83,32.07 7.94,23.18 X1.1 | 26.99,33.02 27.94,33.97 C7.2 | 57.47,23.18 K13.6 55.56,23.18 48.58,23.18 K13.3 46.67,22.23 46.04,21.59 37.15,21.59 27.94,30.8 27.94,31.43 26.99,33.02 | R19.1 79.06,10.16 82.55,6.67 R30.1 R31.1 R32.1 R33.1 R34.1 | v60.01,19.37 57.78,21.59 57.47,23.18
  Bottom 0.406: DCDC3.AC/L 164.22,51.2 158.75,45.72 158.75,43.18 K17.P
  Bottom 3.81: R19.1 66.99,10.16 60.01,17.14 v60.01,19.37
L-MOTOR
  Top 1.905: K13.4 48.58,18.1 55.56,18.1 K13.5
  Bottom 1.905: F1.2 48.26,17.78 K13.4
MISO  (via drill 0.4)
  Top 0.254: v269.24,29.53 269.24,30.48 IC7.14 | IC6.14 265.43,57.15 260.03,51.75 259.4,51.75 U$3.21
  Bottom 0.254: v269.24,29.53 269.24,30.48 267.02,32.7 267.02,35.88 260.35,42.55 260.35,50.48 259.4,51.44 U$3.21
MOSI
  Top 0.254: IC7.13 267.65,31.75 261.3,38.1 261.3,47.31 | 261.3,47.31 259.4,49.21 U$3.19 | IC6.13 269.88,58.42 270.83,57.47 270.83,56.83 261.3,47.31
N
  Bottom 0.406: DCDC3.AC/N 66.92,72 57.15,62.23 40.64,62.23 38.1,59.69 38.1,52.07 33.02,46.99 33.02,31.75 27.94,26.67 27.94,22.86 C7.1
  Bottom 3.81: 27.94,22.86 D6.C 16.83,21.91 13.02,18.1 7.94,18.1 X1.2
N$1
  Top 0.254: K1.2 28.57,55.24 28.57,66.99 30.16,68.58 T1.3
N$2
  Top 0.254: B1.- 7.62,46.99 11.43,50.8 D3.A 17.14,57.78 17.14,73.03 | T1.1 31.75,64.77 R9.1 | D1.A 17.78,72.39 17.14,73.03 | 17.14,73.03 C1.-
  Bottom 0.254: T1.1 30.16,66.04 25.4,70.8 D1.A
N$3
  Bottom 0.254: R1.1 14.92,59.69 12.38,62.23 11.43,62.23 | D2.C 11.43,62.23 | 11.43,62.23 C1.+
N$4
  Bottom 0.254: 22.86,48.26 19.05,44.45 R1.2 | 22.86,48.26 K1.1 | 22.86,48.26 D3.C
N$5
  Top 0.203: IC3.7 230.82,48.26 232.41,46.67 232.41,46.04 234.31,44.13 R13.2
N$6
  Top 0.203: LED1.A 234.95,37.15 233.36,37.15 233.04,37.47 233.04,40.32 R13.1
N$7
  Top 0.254: D1.C 25.4,60.96 R2.1
  Bottom 0.254: R4.2 22.86,73.66 22.86,67.31 D1.C
N$8  (via drill 0.4)
  Top 0.254: IC1.11 242.25,41.91 243.84,43.5 243.84,67.63 v241.3,70.17
  Bottom 0.254: v241.3,70.17 238.44,73.03 237.49,73.03 236.85,73.66 231.46,73.66 226.06,79.06 223.84,79.06 219.71,83.19 215.26,83.19 213.36,81.28 X6.3
N$9
  Top 0.254: T1.2 35.56,67.31 R9.2 R4.1
N$10
  Top 0.254: D2.A 4.76,51.75 4.76,39.69 7.62,36.83 B1.+
  Bottom 0.254: R2.2 21.91,41.91 16.83,36.83 7.62,36.83 B1.+
N$11
  Top 0.203: T3.2 245.43,75.25 245.43,77.79 245.11,78.11 R18.2
  Bottom 0.203: R18.2 240.66,83.19 228.6,83.19 226.69,81.28 223.52,81.28 X6.1
N$12  (via drill 0.6)
  Top 0.508: v87.63,63.5 T2.G
  Bottom 0.508: v87.63,63.5 82.87,58.74 63.82,58.74 K2.4
N$13
  Top 0.508: R5.1 71.12,55.88 K2.3
N$14  (via drill 0.4)
  Top 0.254: IC2.7 221.62,22.86 220.66,23.81 220.66,24.13 220.34,24.45 v220.34,25.4 | v216.85,32.38 216.85,31.43 218.44,29.84 R10.1
  Bottom 0.254: v220.34,25.4 220.34,27.3 R10.1 | IC3.13 231.78,61.59 231.78,45.4 230.5,44.13 228.6,44.13 223.52,39.05 219.39,39.05 218.12,37.78 217.81,37.78 216.85,36.83 v216.85,32.38
N$15  (via drill 0.4)
  Top 0.254: LED2.C 56.83,48.26 56.83,44.13 55.88,43.18 K13.8 | v246.7,43.81 v245.11,42.23 | v227.01,67.63 226.69,67.94 215.26,67.94 200.98,53.66 196.53,53.66 181.61,68.58 154.31,68.58 147.64,75.25 107,75.25 v101.28,65.72
  Bottom 0.254: IC1.18 244.16,26.99 244.16,41.27 v245.11,42.23 | v246.7,43.81 246.7,53.98 241.94,58.74 240.03,58.74 234.63,64.14 234.63,66.67 233.68,67.63 v227.01,67.63 | v101.28,65.72 93.34,65.72 71.44,45.09 57.78,45.09 55.88,43.18 K13.8
N$16  (via drill 0.4)
  Top 1.905: K7.3 170.5,23.18 177.48,23.18 K7.6 | B2.- 144.78,63.82 146.05,62.55 R15.1 146.69,54.29 157.48,43.5 157.48,42.55 v159.38,40.64
  Bottom 1.905: v159.38,40.64 165.1,34.92 165.1,28.26 170.18,23.18 K7.3
N$17
  Top 1.905: C2.1 48.26,62.23 R6.1
N$18  (via drill 0.9)
  Top 1.905: 48.26,70.17 44.45,73.98 L1.2 | C2.2 48.26,70.17 | v68.26,69.53 62.87,69.53 59.05,73.34 54.93,73.34 52.39,70.8 48.9,70.8 48.26,70.17
  Bottom 1.905: v68.26,69.53 124.14,69.53 129.54,64.14 B2.AC1
N$19  (via drill 0.4)
  Top 0.254: v225.11,32.38 224.47,31.75 v224.47,29.84
  Bottom 0.254: 229.87,22.54 IC2.1 C6.1 | IC3.2 228.28,35.56 v225.11,32.38 | v224.47,29.84 229.55,29.84 231.46,27.94 231.46,24.13 229.87,22.54 | 229.87,22.54 IC2.2
N$20
  Top 1.905: K9.5 193.99,18.1 187.01,18.1 K9.4 186.06,17.46 180.34,11.75 180.34,7.94 X4.2
N$21
  Top 1.905: K9.2 187.01,27.94 193.99,27.94 K9.7
  Bottom 1.905: K9.2 186.69,27.94 181.61,22.86 181.61,17.46 178.44,14.29 | 178.44,14.29 174.62,14.29 166.37,6.03 D9.1 | X4.3 185.1,7.94 179.07,13.97 178.44,14.29
N$22
  Top 0.254: R11.1 LED2.A
N$23
  Top 1.422: T2.T1 82.55,78.74 81.92,79.38
  Top 1.905: D5.C 81.92,79.38 75.25,86.04 46.99,86.04 44.45,83.5 L1.1
N$24  (via drill 0.9)
  Top 1.905: C4.1 143.19,44.45 128.27,59.37 124.14,59.37 119.7,63.82 B2.+ | v139.06,26.35 133.35,26.35 128.59,21.59 128.59,16.19 128.27,15.56 128.27,7.94 X5.1
  Bottom 1.905: C4.1 143.19,44.45 142.56,43.81 142.56,29.84 v139.06,26.35 142.24,23.18 D7.2
N$25
  Top 0.203: IC3.9 230.5,53.34 233.68,50.16 C9.1
  Bottom 0.203: Q2.2 234.95,50.8 C9.1
N$26
  Top 0.203: IC3.10 230.82,55.88 234.95,60.01 Q2.1
  Bottom 0.203: C8.1 233.68,62.23 234.95,60.96 Q2.1
N$27  (via drill 0.4)
  Top 0.203: IC3.12 227.97,60.96 226.06,59.05 v225.11,59.05
  Bottom 0.203: v225.11,59.05 225.11,66.99 R12.1
N$28  (via drill 0.4)
  Top 0.254: v236.54,67.63 233.68,70.48 R17.1
  Bottom 0.254: C11.1 232.41,72.39 R17.1 | IC4.3 237.81,63.18 237.81,66.36 v236.54,67.63
N$29
  Top 0.254: IC4.4 240.35,57.15 238.44,59.05 238.44,70.17 238.76,70.48 R16.1
  Bottom 0.254: C12.1 241.94,69.22 240.66,69.22 R16.1 236.85,69.22 230.19,69.22 227.01,72.39 R12.2
N$30  (via drill 0.4)
  Top 0.254: K14.8 72.39,43.18 73.34,44.13 73.34,48.26 LED3.C 73.66,48.26 74.93,49.53 105.09,49.53 109.22,53.66 109.22,58.74 125.09,74.61 147.64,74.61 171.45,50.8 206.69,50.8 212.41,56.52 219.07,56.52 219.71,55.88 219.71,55.24 220.66,54.29 223.52,54.29 223.84,53.98 225.11,53.98 226.69,52.39 226.69,50.48 227.97,49.21 231.14,49.21 233.04,47.31 233.04,46.04 234,45.09 235.27,45.09 235.59,45.4 v237.81,43.18
  Bottom 0.254: IC1.17 239.08,28.89 239.08,41.91 v237.81,43.18
N$31
  Bottom 0.635: R14.1 119.38,45.72 R15.2
N$32
  Top 0.635: R14.2 116.2,44.45 119.06,47.31 125.41,47.31 128.27,44.45 C4.2
N$33
  Top 1.905: K9.6 193.99,23.18 187.01,23.18 K9.3 186.06,23.5 182.56,23.5 178.44,27.62 K7.7 177.48,27.94 170.5,27.94 K7.2 169.54,27.94 161.93,27.94 K6.7 160.97,27.94 153.99,27.94 K6.2
N$34
  Top 1.905: 175.26,18.1 177.48,18.1 K7.5 | 175.26,18.1 170.5,18.1 K7.4 | 175.26,18.1 175.26,7.94 X4.1
  Bottom 1.905: 153.67,16.19 153.67,17.78 K6.4 154.62,18.1 158.75,18.1 | 158.75,18.1 160.97,18.1 K6.5 | 161.29,17.14 K6.5 | K7.4 170.18,18.1 161.93,18.1 K6.5 | 158.75,18.1 D9.2
N$35
  Top 1.905: K6.3 153.99,23.18 160.97,23.18 K6.6 | X5.2 133.35,7.62 136.21,7.62 138.11,5.71 149.86,5.71 D7.1
  Bottom 1.905: K6.3 153.67,22.86 149.54,18.73 149.54,16.51 149.86,15.88 D7.1
N$36
  Top 0.254: IC5.18 201.61,46.04 164.15,46.04 161.29,43.18 K6.8
N$37
  Bottom 0.254: R16.2 238.76,80.96 X3.1
N$38
  Bottom 0.254: R17.2 233.68,80.96 X3.2
N$39
  Top 0.254: C15.1 211.46,32.38 211.46,27.94 213.36,26.04 R20.2
  Bottom 0.254: IC2.6 220.03,23.18 220.03,20.95 218.76,19.68 215.26,19.68 R21.1 R20.2
N$40
  Top 0.254: R24.1 LED3.A
N$41
  Top 0.254: C13.1 217.81,34.29 216.85,33.34 216.53,33.34 215.9,32.7 215.9,28.57 218.44,26.04 R10.2
  Bottom 0.254: R23.2 228.28,15.24 | 228.28,15.24 R22.1 | R10.2 218.44,24.45 | 218.44,24.45 D10.C | 222.25,26.99 IC2.5 | 222.25,26.99 221.3,26.04 221.3,25.08 220.66,24.45 218.44,24.45 | 228.28,15.24 228.28,22.86 229.87,24.45 230.5,24.45 230.82,24.77 230.82,26.04 229.87,26.99 222.25,26.99
N$42  (via drill 0.4)
  Top 0.254: v102.87,34.61 103.82,35.56 LED4.C | IC1.16 242.25,29.21 246.38,25.08 246.38,23.18 v253.37,16.19 | v246.06,8.89 v247.65,10.48 | v135.89,22.54 138.75,22.54 145.41,15.88 147.64,15.88 v160.97,2.54
  Bottom 0.254: v102.87,34.61 101.28,33.02 101.28,23.18 K16.2 106.05,22.23 135.25,22.23 135.57,22.54 v135.89,22.54 | v247.65,10.48 v253.37,16.19 | v246.06,8.89 240.66,8.89 239.71,9.84 229.55,9.84 225.43,5.71 223.52,5.71 220.03,9.21 219.39,9.21 212.72,2.54 v160.97,2.54
N$43
  Bottom 0.254: U$3.31 259.08,64.45 258.13,64.45 256.86,65.72 256.22,65.72 251.78,70.17 251.78,80.01 244.16,87.63 214.63,87.63 208.28,81.28 X6.4
N$44  (via drill 0.4)
  Top 0.254: v247.01,82.87 247.01,77.79 247.97,76.83 250.19,76.83 256.22,70.8 256.86,70.8 258.13,69.53 259.08,69.53 U$3.35
  Bottom 0.254: v247.01,82.87 246.38,82.87 242.25,87 215.9,87 207.96,79.06 205.1,79.06 203.2,80.96 X6.5
N$45
  Top 0.254: R25.1 LED4.A
N$46
  Top 0.254: R26.1 LED5.A
N$49  (via drill 0.4)
  Top 0.254: 149.22,32.38 146.05,35.56 LED6.C | 149.22,32.38 149.22,23.5 K17.2 | IC1.13 237.81,36.83 236.22,35.24 v235.59,35.24 | v220.03,38.1 218.76,39.37 v218.76,39.69 | v212.09,38.42 208.28,34.61 151.45,34.61 149.22,32.38
  Bottom 0.254: v235.59,35.24 234.95,35.24 231.14,39.05 225.43,39.05 223.52,37.15 220.98,37.15 v220.03,38.1 | v218.76,39.69 213.36,39.69 v212.09,38.42
N$50
  Top 0.254: R27.1 LED6.A
N$51  (via drill 0.4)
  Top 0.254: v134.3,35.56 LED7.C | K12.2 v134.94,23.18 | v234.95,34.29 IC1.14 | v217.81,35.56 217.49,35.24 209.87,42.86 206.06,42.86 201.61,47.31 197.8,47.31 197.49,47.62 v156.84,47.62
  Bottom 0.254: v134.94,23.18 134.94,31.11 134.3,31.75 v134.3,35.56 134.3,38.73 143.19,47.62 v156.84,47.62 | v234.95,34.29 234.31,34.29 231.46,37.15 226.06,37.15 225.43,37.78 224.79,37.78 223.52,36.51 219.71,36.51 218.76,35.56 v217.81,35.56
N$52
  Top 0.254: R28.1 LED7.A
N$53  (via drill 0.4)
  Top 0.254: v116.84,34.61 117.79,35.56 LED8.C 118.11,35.56 122.24,39.69 141.6,39.69 145.73,43.81 145.73,45.09 140.97,49.85 140.97,64.45 143.83,67.31 145.1,67.31 148.27,64.14 148.27,59.05 148.91,58.42 148.91,57.78 153.99,52.7 157.16,52.7 159.07,54.61 167,54.61 172.72,48.9 197.49,48.9 197.8,48.58 201.93,48.58 202.25,48.9 v208.28,48.9 | K8.2 v115.25,23.18 | IC1.15 238.76,31.75 237.49,33.02 v234.95,33.02 | v225.11,36.83 225.43,37.15 225.43,40.96 v224.79,41.59
  Bottom 0.254: v116.84,34.61 115.25,33.02 v115.25,23.18 | v234.95,33.02 231.46,36.51 225.43,36.51 v225.11,36.83 | v224.79,41.59 217.49,41.59 214.31,44.77 211.77,44.77 208.28,48.26 v208.28,48.9
N$54
  Top 0.254: R29.1 LED8.A
N$55  (via drill 0.4)
  Top 0.254: LED5.C 89.85,48.26 89.85,44.13 88.9,43.18 K15.8 | v227.97,42.23 227.01,43.18 v227.01,43.81 | v209.55,48.26 209.23,47.94 197.8,47.94 197.49,48.26 159.38,48.26 v158.75,48.9
  Bottom 0.254: IC1.12 243.21,41.27 243.21,44.77 242.57,45.4 234.95,45.4 231.78,42.23 v227.97,42.23 | v227.01,43.81 225.11,43.81 223.52,42.23 219.07,42.23 215.9,45.4 212.09,45.4 209.55,47.94 v209.55,48.26 | v158.75,48.9 126.68,48.9 120.33,42.55 89.22,42.55 88.9,42.86 K15.8
N$57  (via drill 0.4)
  Top 0.203: v212.72,46.99 v209.87,44.13 | v224.47,46.99 225.43,47.94 225.43,48.58 v225.11,48.9 | v230.82,54.61 231.46,55.24 233.68,53.02 236.85,53.02 v238.76,51.12
  Bottom 0.203: IC5.2 202.25,38.1 205.74,34.61 208.28,34.61 209.87,36.2 v209.87,44.13 | v212.72,46.99 215.58,46.99 217.81,44.77 223.52,44.77 224.47,45.72 v224.47,46.99 | v225.11,48.9 225.11,50.8 228.6,54.29 230.5,54.29 v230.82,54.61 | v238.76,51.12 240.03,51.12 240.98,52.07 IC4.6
N$58
  Bottom 0.254: U$3.37 259.08,71.75 259.08,70.8 258.13,69.85 258.13,66.36 259.08,65.41 259.71,65.41 260.35,64.77 260.35,63.82 259.71,63.18 256.22,63.18 249.24,70.17 249.24,75.25 250.51,76.52 250.51,78.74 248.92,80.33 248.28,80.33 242.25,86.36 215.9,86.36 207.96,78.42 200.66,78.42 198.12,80.96 X6.6
N$60
  Top 0.254: IC5.17 201.61,38.1 200.03,39.69 198.12,39.69 196.22,41.59 196.22,44.45 195.26,45.4 180.02,45.4 177.8,43.18 K7.8
N$62
  Bottom 0.254: IC5.16 199.71,42.86 194.31,42.86 K9.8
N$63
  Top 3.81: K14.4 65.09,18.1 72.07,18.1 K14.5 72.71,16.19 72.71,8.26 | 72.71,8.26 75.88,5.08 R19.2 | X2.1 20.32,8.89 21.59,7.62 21.59,6.99 25.4,3.17 66.99,3.17 71.12,7.3 72.71,8.26
N$64  (via drill 0.4)
  Top 0.508: v51.44,14.92 31.11,14.92 25.4,9.21 X2.2
  Bottom 0.508: R30.2 89.22,10.16 94.61,15.56 | 94.61,15.56 96.52,17.46 K16.S | v51.44,14.92 53.34,16.83 53.34,23.81 54.93,25.4 83.19,25.4 88.27,20.32 89.85,20.32 94.61,15.56
N$65
  Bottom 0.508: 99.22,15.08 99.38,15.24 99.38,21.27 89.53,31.11 55.56,31.11 51.44,26.99 51.44,17.46 48.9,14.92 36.2,14.92 30.48,9.21 X2.3 | 99.22,15.08 94.3,10.16 R31.2 | K8.S 107.63,14.92 99.38,14.92 99.22,15.08
N$66  (via drill 0.4)
  Top 0.508: v73.03,3.17 74.61,1.59 115.25,1.59 117.47,3.81 117.47,6.35 115.57,8.26 111.44,8.26 109.54,10.16 R33.2
  Bottom 0.508: R33.2 113.35,10.16 118.11,14.92 121.6,14.92 K12.S | v73.03,3.17 69.22,3.17 63.5,8.89 45.72,8.89 X2.6
N$67  (via drill 0.4)
  Top 0.508: v89.53,13.02 98.74,13.02 101.6,10.16 R32.2 | v69.22,13.65 68.26,12.7 44.13,12.7 40.64,9.21 X2.5
  Bottom 0.508: v89.53,13.02 82.23,20.32 78.11,20.32 78.11,18.1 73.66,13.65 v69.22,13.65 | K17.S 131.44,10.79 121.28,10.79 118.43,7.94 104.14,7.94 101.92,10.16 R32.2
N$68
  Top 0.508: K15.4 81.6,18.1 88.58,18.1 K15.5 88.9,17.78 91.76,14.92 108.27,14.92 113.03,10.16 R34.2
  Bottom 0.508: 81.28,17.78 K15.4 81.6,17.78 82.23,17.14 82.23,7.62 75.88,1.27 43.18,1.27 35.56,8.89 X2.4
N$78  (via drill 0.6)
  other vias: 227.33,21.59
N_MOTOR
  Bottom 1.905: B1.AC2 7.62,41.59 3.49,37.47 3.49,16.19 6.67,13.02 7.62,13.02 X1.3 8.57,13.02 25.4,13.02 28.89,16.51 29.21,16.51 34.61,21.91 34.61,27.94 37.47,30.8 46.99,30.8 55.56,39.37 81.92,39.37 85.09,42.55 85.09,43.5 90.17,48.58 110.81,48.58 D5.A 124.14,54.61 128.91,59.37 132.72,59.37 137.16,63.82 B2.AC2
NTC
  Bottom 0.254: 201.93,13.97 C10.1 | R8.1 201.93,13.97 | IC2.3 225.43,20.95 225.43,8.89 226.06,8.26 226.06,6.99 225.43,6.35 223.52,6.35 220.03,9.84 213.68,9.84 209.55,5.71 201.29,5.71 199.39,7.62 X8.1 199.39,7.94 201.93,10.48 201.93,13.97
PGC  (via drill 0.4)
  Top 0.203: IC3.27 221.62,35.56 219.07,38.1 219.07,38.42 217.81,39.69 v217.81,45.72 | v210.19,55.56 208.6,57.15 208.6,60.33 211.77,63.5 v212.09,63.5
  Bottom 0.203: v217.81,45.72 217.81,46.35 214,50.16 214,51.75 v210.19,55.56 | v212.09,63.5 206.69,63.5 184.47,85.72 183.51,85.72 JP1.5
PGD  (via drill 0.4)
  Top 0.203: IC3.28 223.2,33.02 224.79,34.61 224.79,36.2 224.16,36.83 224.79,37.47 224.79,40.64 223.84,41.59 225.43,43.18 225.43,45.09 223.2,47.31 220.66,47.31 219.07,48.9 212.72,48.9 212.41,48.58 210.19,48.58 208.91,49.85 v205.74,49.85 | v191.45,60.33 177.16,74.61 177.16,80.33 179.07,82.23 JP1.4
  Bottom 0.203: v205.74,49.85 201.93,49.85 v191.45,60.33
PGM  (via drill 0.4)
  Top 0.203: IC3.26 221.3,38.1 219.71,39.69 v219.71,45.72 | v208.28,55.56 204.47,52.7 196.22,52.7 v184.15,64.77
  Bottom 0.203: v219.71,45.72 219.71,47.31 213.68,53.34 213.36,53.34 210.19,56.52 209.23,56.52 v208.28,55.56 | JP1.6 v184.15,64.77
PWM0
  Top 0.254: SV1.33 294.32,30.48 295.59,31.75 296.23,31.75 297.81,33.34 297.81,70.8 292.42,76.2 259.4,76.2 258.13,74.93 258.13,73.98 259.08,73.03 259.71,73.03 260.99,71.75 260.99,66.99 259.4,65.41 257.81,65.41 256.86,64.45 U$3.32
PWM1
  Bottom 0.254: SV1.34 300.67,35.24 300.67,70.48 293.69,77.79 287.02,81.92 274.64,81.92 259.4,66.67 U$3.33
RX  (via drill 0.4)
  Top 0.254: IC3.18 223.2,58.42 v227.01,62.23
  Bottom 0.254: v227.01,62.23 227.01,62.87 228.6,64.45 231.14,64.45 232.41,63.18 232.41,49.21 235.59,46.04 242.57,46.04 248.28,40.32 250.19,40.32 256.54,33.97 U$3.8
SCK  (via drill 0.4)
  Top 0.254: v267.97,33.02 IC7.12 | v267.97,59.69 IC6.12
  Bottom 0.254: v267.97,33.02 267.97,35.56 260.99,42.55 260.99,52.7 | 260.99,52.7 259.4,54.29 U$3.23 | 260.99,52.7 v267.97,59.69
SCL  (via drill 0.4)
  Top 0.254: v247.01,11.43 245.43,9.84 237.17,9.84 234.95,7.62 X8.8
  Bottom 0.254: v247.01,11.43 247.97,11.43 252.41,15.88 252.41,26.04 256.22,29.84 256.86,29.84 258.13,31.11 259.08,31.11 U$3.5
SDA  (via drill 0.4)
  Top 0.254: v254.63,2.54 v259.08,6.99
  Bottom 0.254: v259.08,6.99 259.08,11.11 265.11,17.14 265.11,23.5 260.03,28.57 259.4,28.57 U$3.3 | v254.63,2.54 234.95,2.54 229.87,7.62 X8.7
SUPPLY_MOTOR
  Top 1.422: R5.2 87.63,58.42 85.09,60.96 T2.T2
  Top 1.905: B1.AC1 10.79,31.75 17.46,38.42 35.88,38.42 F1.1 | R5.2 76.52,55.88 73.03,52.39 66.67,52.39 64.45,54.61 R6.2
  Bottom 1.905: R6.2 52.07,54.61 F1.1
TACHO
  Bottom 0.254: 210.82,12.06 210.82,9.21 209.55,7.94 X8.3 | 210.82,12.06 C14.1 | R22.2 221.93,15.24 218.76,12.06 210.82,12.06
TRIAC  (via drill 0.4)
  Top 0.406: v214.63,55.56 v213.36,54.29
  Bottom 0.406: IC3.6 227.01,45.72 223.2,49.53 218.44,49.53 213.68,54.29 v213.36,54.29 | v214.63,55.56 214.63,60.01 212.72,61.91 183.51,61.91 169.23,76.2 K2.1
TX  (via drill 0.4)
  Top 0.254: IC3.17 223.2,60.96 v227.01,64.77
  Bottom 0.254: v227.01,64.77 227.97,64.77 228.28,65.09 231.14,65.09 233.04,63.18 233.04,61.28 238.76,55.56 242.57,55.56 245.75,52.39 245.75,43.5 246.38,42.86 250.19,42.86 256.54,36.51 U$3.10
VPP  (via drill 0.4)
  Top 0.203: IC3.1 231.78,33.02 234.95,36.2 236.54,36.2 238.76,38.42 238.76,50.16 239.71,51.12 237.81,53.02 237.81,68.58 v236.22,70.17 | v173.04,86.36 171.45,84.77 JP1.1
  Bottom 0.203: v236.22,70.17 233.36,73.03 229.55,73.03 228.6,73.98 227.65,73.98 219.07,82.55 216.53,82.55 211.77,77.79 200.66,77.79 199.39,79.06 192.41,79.06 185.1,86.36 v173.04,86.36

## Text on the board
tNames: +12 | OV | GND | S+ | S- | L | N | ROTOR | STATOR | NM | HT | P1 | P2 | D | W1 | W2 | WashBerryPi 1.1 | OR | GR | BL | YE | PU | NTC | GND | T | T | 5V | 3V3 | SDA | SCL | GND